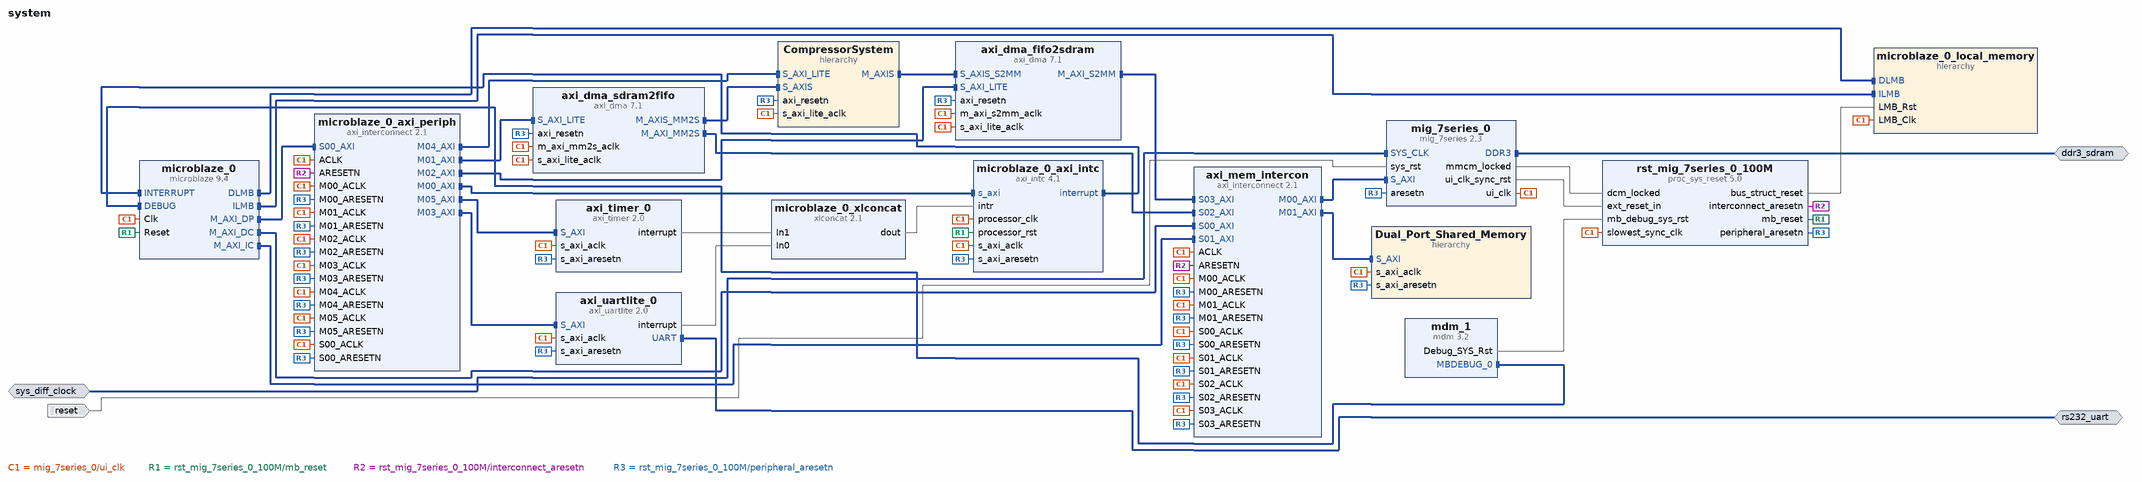
[diagram p0: block diagram of the top level]
# Vivado block design system, Vivado 2014.4
create_bd_design system

create_bd_intf_port -mode Master -vlnv xilinx.com:interface:ddrx_rtl:1.0 ddr3_sdram
create_bd_intf_port -mode Slave -vlnv xilinx.com:interface:diff_clock_rtl:1.0 sys_diff_clock
set_property -dict {CONFIG.FREQ_HZ 100000000} [get_bd_intf_ports sys_diff_clock]
create_bd_intf_port -mode Master -vlnv xilinx.com:interface:uart_rtl:1.0 rs232_uart
create_bd_port -dir I -type rst reset
set_property -dict {CONFIG.POLARITY ACTIVE_HIGH} [get_bd_ports reset]

create_bd_cell -type ip -vlnv xilinx.com:ip:microblaze:9.4 microblaze_0
set_property -dict [list \
  CONFIG.C_D_AXI 1 \
  CONFIG.C_D_LMB 1 \
  CONFIG.C_I_LMB 1 \
  CONFIG.G_TEMPLATE_LIST 2 \
  CONFIG.C_USE_MSR_INSTR 1 \
  CONFIG.C_USE_PCMP_INSTR 1 \
  CONFIG.C_USE_BARREL 1 \
  CONFIG.C_USE_DIV 1 \
  CONFIG.C_USE_HW_MUL 2 \
  CONFIG.C_USE_FPU 2 \
  CONFIG.C_DEBUG_ENABLED 1 \
  CONFIG.C_USE_ICACHE 1 \
  CONFIG.C_CACHE_BYTE_SIZE 32768 \
  CONFIG.C_ICACHE_LINE_LEN 8 \
  CONFIG.C_ICACHE_VICTIMS 8 \
  CONFIG.C_ICACHE_STREAMS 1 \
  CONFIG.C_USE_DCACHE 1 \
  CONFIG.C_DCACHE_BYTE_SIZE 32768 \
  CONFIG.C_DCACHE_LINE_LEN 8 \
  CONFIG.C_DCACHE_USE_WRITEBACK 1 \
  CONFIG.C_DCACHE_VICTIMS 8 \
  CONFIG.C_USE_BRANCH_TARGET_CACHE 1 \
] [get_bd_cells microblaze_0]
create_bd_cell -type ip -vlnv xilinx.com:ip:mig_7series:2.3 mig_7series_0
set_property -dict {CONFIG.RESET_BOARD_INTERFACE reset CONFIG.BOARD_MIG_PARAM ddr3_sdram} [get_bd_cells mig_7series_0]
create_bd_cell -type hier microblaze_0_local_memory
create_bd_cell -type ip -vlnv xilinx.com:ip:axi_interconnect:2.1 microblaze_0_axi_periph
set_property -dict {CONFIG.NUM_MI 6} [get_bd_cells microblaze_0_axi_periph]
create_bd_cell -type ip -vlnv xilinx.com:ip:axi_intc:4.1 microblaze_0_axi_intc
set_property -dict {CONFIG.C_HAS_FAST 1} [get_bd_cells microblaze_0_axi_intc]
create_bd_cell -type ip -vlnv xilinx.com:ip:xlconcat:2.1 microblaze_0_xlconcat
create_bd_cell -type ip -vlnv xilinx.com:ip:mdm:3.2 mdm_1
create_bd_cell -type ip -vlnv xilinx.com:ip:proc_sys_reset:5.0 rst_mig_7series_0_100M
create_bd_cell -type ip -vlnv xilinx.com:ip:axi_dma:7.1 axi_dma_fifo2sdram
set_property -dict {CONFIG.c_include_sg 0 CONFIG.c_sg_length_width 23 CONFIG.c_include_mm2s 0} [get_bd_cells axi_dma_fifo2sdram]
create_bd_cell -type ip -vlnv xilinx.com:ip:axi_uartlite:2.0 axi_uartlite_0
set_property -dict [list \
  CONFIG.C_BAUDRATE 115200 \
  CONFIG.USE_BOARD_FLOW true \
  CONFIG.UARTLITE_BOARD_INTERFACE rs232_uart \
] [get_bd_cells axi_uartlite_0]
create_bd_cell -type ip -vlnv xilinx.com:ip:axi_timer:2.0 axi_timer_0
create_bd_cell -type hier Dual_Port_Shared_Memory
create_bd_cell -type ip -vlnv xilinx.com:ip:axi_interconnect:2.1 axi_mem_intercon
set_property -dict {CONFIG.NUM_SI 4 CONFIG.NUM_MI 2} [get_bd_cells axi_mem_intercon]
create_bd_cell -type hier CompressorSystem
create_bd_cell -type ip -vlnv xilinx.com:ip:axi_dma:7.1 axi_dma_sdram2fifo
set_property -dict {CONFIG.c_include_sg 0 CONFIG.c_sg_length_width 23 CONFIG.c_include_s2mm 0} [get_bd_cells axi_dma_sdram2fifo]

# ---- hierarchy /microblaze_0_local_memory ----
current_bd_instance /microblaze_0_local_memory
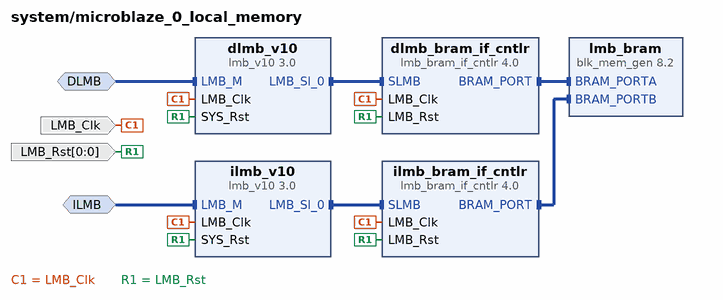
[diagram p1: block diagram inside /microblaze_0_local_memory]
create_bd_intf_pin -mode MirroredMaster -vlnv xilinx.com:interface:lmb_rtl:1.0 DLMB
create_bd_intf_pin -mode MirroredMaster -vlnv xilinx.com:interface:lmb_rtl:1.0 ILMB
create_bd_pin -dir I -type clk LMB_Clk
create_bd_pin -dir I -from 0 -to 0 -type rst LMB_Rst

create_bd_cell -type ip -vlnv xilinx.com:ip:lmb_v10:3.0 dlmb_v10
create_bd_cell -type ip -vlnv xilinx.com:ip:lmb_v10:3.0 ilmb_v10
create_bd_cell -type ip -vlnv xilinx.com:ip:lmb_bram_if_cntlr:4.0 dlmb_bram_if_cntlr
set_property -dict {CONFIG.C_ECC 0} [get_bd_cells dlmb_bram_if_cntlr]
create_bd_cell -type ip -vlnv xilinx.com:ip:lmb_bram_if_cntlr:4.0 ilmb_bram_if_cntlr
set_property -dict {CONFIG.C_ECC 0} [get_bd_cells ilmb_bram_if_cntlr]
create_bd_cell -type ip -vlnv xilinx.com:ip:blk_mem_gen:8.2 lmb_bram
set_property -dict {CONFIG.Memory_Type True_Dual_Port_RAM CONFIG.use_bram_block BRAM_Controller} [get_bd_cells lmb_bram]

# ---- hierarchy /Dual_Port_Shared_Memory ----
current_bd_instance /Dual_Port_Shared_Memory
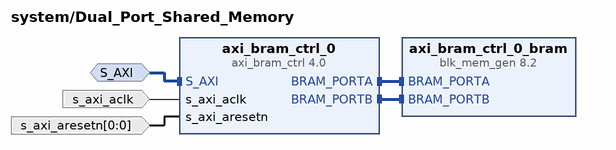
[diagram p2: block diagram inside /Dual_Port_Shared_Memory]
create_bd_intf_pin -mode Slave -vlnv xilinx.com:interface:aximm_rtl:1.0 S_AXI
create_bd_pin -dir I -type clk s_axi_aclk
create_bd_pin -dir I -from 0 -to 0 -type rst s_axi_aresetn

create_bd_cell -type ip -vlnv xilinx.com:ip:axi_bram_ctrl:4.0 axi_bram_ctrl_0
create_bd_cell -type ip -vlnv xilinx.com:ip:blk_mem_gen:8.2 axi_bram_ctrl_0_bram
set_property -dict {CONFIG.Memory_Type True_Dual_Port_RAM} [get_bd_cells axi_bram_ctrl_0_bram]

# ---- hierarchy /CompressorSystem ----
current_bd_instance /CompressorSystem
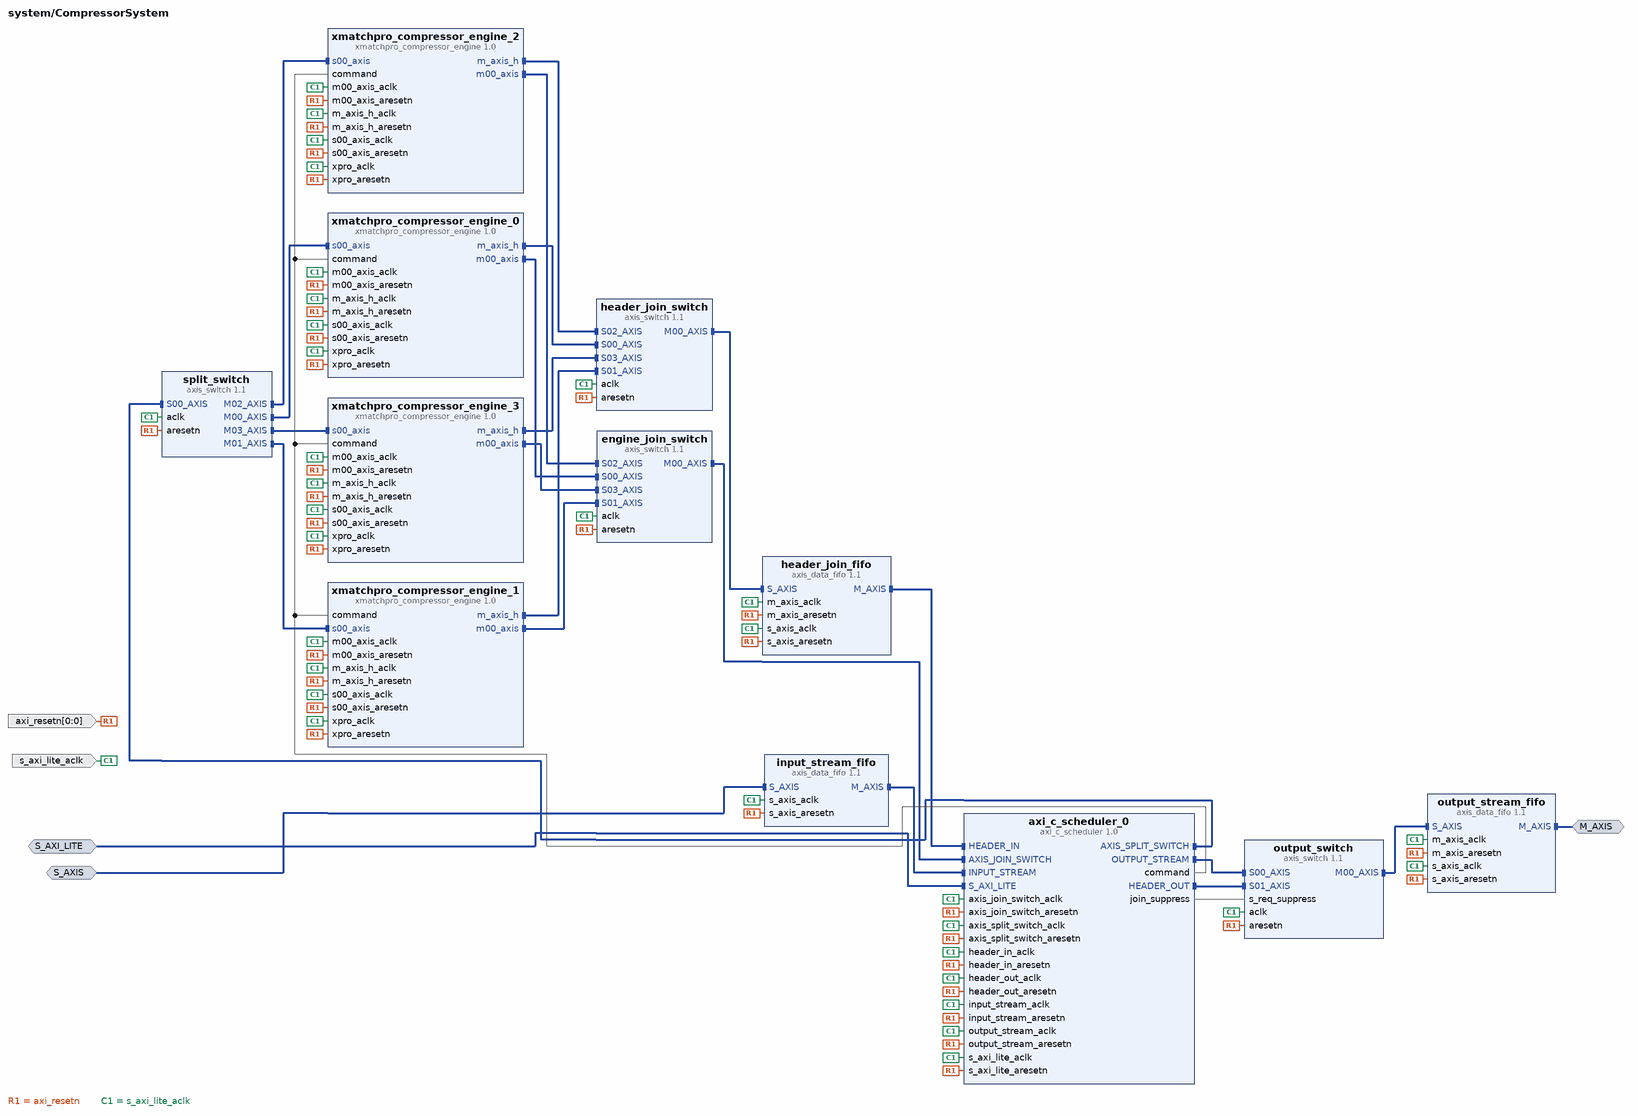
[diagram p3: block diagram inside /CompressorSystem]
create_bd_intf_pin -mode Slave -vlnv xilinx.com:interface:aximm_rtl:1.0 S_AXI_LITE
create_bd_intf_pin -mode Master -vlnv xilinx.com:interface:axis_rtl:1.0 M_AXIS
create_bd_intf_pin -mode Slave -vlnv xilinx.com:interface:axis_rtl:1.0 S_AXIS
create_bd_pin -dir I -from 0 -to 0 -type rst axi_resetn
create_bd_pin -dir I -type clk s_axi_lite_aclk

create_bd_cell -type ip -vlnv mohdazainol:user_ip:xmatchpro_compressor_engine:1.0 xmatchpro_compressor_engine_2
create_bd_cell -type ip -vlnv xilinx.com:ip:axis_switch:1.1 engine_join_switch
set_property -dict [list \
  CONFIG.NUM_SI 4 \
  CONFIG.TDATA_NUM_BYTES 4 \
  CONFIG.HAS_TLAST 1 \
  CONFIG.ARB_ON_MAX_XFERS 0 \
  CONFIG.ARB_ON_TLAST 1 \
] [get_bd_cells engine_join_switch]
create_bd_cell -type ip -vlnv mohdazainol:user_ip:xmatchpro_compressor_engine:1.0 xmatchpro_compressor_engine_3
create_bd_cell -type ip -vlnv xilinx.com:ip:axis_switch:1.1 header_join_switch
set_property -dict [list \
  CONFIG.NUM_SI 4 \
  CONFIG.TDATA_NUM_BYTES 4 \
  CONFIG.HAS_TLAST 1 \
  CONFIG.ARB_ON_MAX_XFERS 0 \
  CONFIG.ARB_ON_TLAST 1 \
] [get_bd_cells header_join_switch]
create_bd_cell -type ip -vlnv xilinx.com:ip:axis_switch:1.1 split_switch
set_property -dict [list \
  CONFIG.NUM_SI 1 \
  CONFIG.NUM_MI 4 \
  CONFIG.TDATA_NUM_BYTES 4 \
  CONFIG.HAS_TLAST 1 \
  CONFIG.TDEST_WIDTH 4 \
  CONFIG.DECODER_REG 1 \
] [get_bd_cells split_switch]
create_bd_cell -type ip -vlnv xilinx.com:ip:axis_data_fifo:1.1 header_join_fifo
set_property -dict [list \
  CONFIG.TDATA_NUM_BYTES 4 \
  CONFIG.IS_ACLK_ASYNC 1 \
  CONFIG.HAS_TLAST 1 \
  CONFIG.SYNCHRONIZATION_STAGES 3 \
] [get_bd_cells header_join_fifo]
create_bd_cell -type ip -vlnv mohdazainol:user_ip:axi_c_scheduler:1.0 axi_c_scheduler_0
create_bd_cell -type ip -vlnv xilinx.com:ip:axis_switch:1.1 output_switch
set_property -dict [list \
  CONFIG.TDATA_NUM_BYTES 4 \
  CONFIG.HAS_TLAST 1 \
  CONFIG.ARB_ON_MAX_XFERS 1024 \
  CONFIG.ARB_ON_NUM_CYCLES 64 \
  CONFIG.ARB_ALGORITHM 1 \
] [get_bd_cells output_switch]
create_bd_cell -type ip -vlnv xilinx.com:ip:axis_data_fifo:1.1 input_stream_fifo
set_property -dict {CONFIG.TDATA_NUM_BYTES 4 CONFIG.IS_ACLK_ASYNC 0 CONFIG.HAS_TLAST 1} [get_bd_cells input_stream_fifo]
create_bd_cell -type ip -vlnv mohdazainol:user_ip:xmatchpro_compressor_engine:1.0 xmatchpro_compressor_engine_0
create_bd_cell -type ip -vlnv mohdazainol:user_ip:xmatchpro_compressor_engine:1.0 xmatchpro_compressor_engine_1
create_bd_cell -type ip -vlnv xilinx.com:ip:axis_data_fifo:1.1 output_stream_fifo
set_property -dict [list \
  CONFIG.TDATA_NUM_BYTES 4 \
  CONFIG.IS_ACLK_ASYNC 1 \
  CONFIG.HAS_TLAST 1 \
  CONFIG.SYNCHRONIZATION_STAGES 3 \
] [get_bd_cells output_stream_fifo]

# ---- connections ----

current_bd_instance /microblaze_0_local_memory
connect_bd_intf_net -intf_net microblaze_0_dlmb_bus [get_bd_intf_pins dlmb_v10/LMB_Sl_0] [get_bd_intf_pins dlmb_bram_if_cntlr/SLMB]
connect_bd_intf_net -intf_net microblaze_0_ilmb_bus [get_bd_intf_pins ilmb_v10/LMB_Sl_0] [get_bd_intf_pins ilmb_bram_if_cntlr/SLMB]
connect_bd_intf_net -intf_net microblaze_0_dlmb_cntlr [get_bd_intf_pins dlmb_bram_if_cntlr/BRAM_PORT] [get_bd_intf_pins lmb_bram/BRAM_PORTA]
connect_bd_intf_net -intf_net microblaze_0_ilmb_cntlr [get_bd_intf_pins ilmb_bram_if_cntlr/BRAM_PORT] [get_bd_intf_pins lmb_bram/BRAM_PORTB]
connect_bd_intf_net -intf_net microblaze_0_dlmb [get_bd_intf_pins DLMB] [get_bd_intf_pins dlmb_v10/LMB_M]
connect_bd_intf_net -intf_net microblaze_0_ilmb [get_bd_intf_pins ILMB] [get_bd_intf_pins ilmb_v10/LMB_M]
connect_bd_net -net microblaze_0_Clk [get_bd_pins LMB_Clk] \
  [get_bd_pins dlmb_v10/LMB_Clk] [get_bd_pins dlmb_bram_if_cntlr/LMB_Clk] [get_bd_pins ilmb_v10/LMB_Clk] \
  [get_bd_pins ilmb_bram_if_cntlr/LMB_Clk]
connect_bd_net -net microblaze_0_LMB_Rst [get_bd_pins LMB_Rst] \
  [get_bd_pins dlmb_v10/SYS_Rst] [get_bd_pins dlmb_bram_if_cntlr/LMB_Rst] [get_bd_pins ilmb_v10/SYS_Rst] \
  [get_bd_pins ilmb_bram_if_cntlr/LMB_Rst]

current_bd_instance /Dual_Port_Shared_Memory
connect_bd_intf_net [get_bd_intf_pins axi_bram_ctrl_0_bram/BRAM_PORTA] [get_bd_intf_pins axi_bram_ctrl_0/BRAM_PORTA]
connect_bd_intf_net [get_bd_intf_pins axi_bram_ctrl_0_bram/BRAM_PORTB] [get_bd_intf_pins axi_bram_ctrl_0/BRAM_PORTB]
connect_bd_intf_net [get_bd_intf_pins S_AXI] [get_bd_intf_pins axi_bram_ctrl_0/S_AXI]
connect_bd_net [get_bd_pins s_axi_aclk] [get_bd_pins axi_bram_ctrl_0/s_axi_aclk]
connect_bd_net [get_bd_pins s_axi_aresetn] [get_bd_pins axi_bram_ctrl_0/s_axi_aresetn]

current_bd_instance /CompressorSystem
connect_bd_intf_net [get_bd_intf_pins split_switch/M02_AXIS] [get_bd_intf_pins xmatchpro_compressor_engine_2/s00_axis]
connect_bd_intf_net [get_bd_intf_pins xmatchpro_compressor_engine_2/m00_axis] [get_bd_intf_pins engine_join_switch/S02_AXIS]
connect_bd_intf_net [get_bd_intf_pins header_join_switch/S02_AXIS] [get_bd_intf_pins xmatchpro_compressor_engine_2/m_axis_h]
connect_bd_intf_net [get_bd_intf_pins xmatchpro_compressor_engine_0/m00_axis] [get_bd_intf_pins engine_join_switch/S00_AXIS]
connect_bd_intf_net [get_bd_intf_pins engine_join_switch/M00_AXIS] [get_bd_intf_pins axi_c_scheduler_0/AXIS_JOIN_SWITCH]
connect_bd_intf_net [get_bd_intf_pins engine_join_switch/S01_AXIS] [get_bd_intf_pins xmatchpro_compressor_engine_1/m00_axis]
connect_bd_intf_net [get_bd_intf_pins engine_join_switch/S03_AXIS] [get_bd_intf_pins xmatchpro_compressor_engine_3/m00_axis]
connect_bd_intf_net [get_bd_intf_pins xmatchpro_compressor_engine_3/s00_axis] [get_bd_intf_pins split_switch/M03_AXIS]
connect_bd_intf_net [get_bd_intf_pins header_join_switch/S03_AXIS] [get_bd_intf_pins xmatchpro_compressor_engine_3/m_axis_h]
connect_bd_intf_net [get_bd_intf_pins header_join_switch/S00_AXIS] [get_bd_intf_pins xmatchpro_compressor_engine_0/m_axis_h]
connect_bd_intf_net [get_bd_intf_pins header_join_switch/M00_AXIS] [get_bd_intf_pins header_join_fifo/S_AXIS]
connect_bd_intf_net [get_bd_intf_pins xmatchpro_compressor_engine_1/m_axis_h] [get_bd_intf_pins header_join_switch/S01_AXIS]
connect_bd_intf_net [get_bd_intf_pins axi_c_scheduler_0/AXIS_SPLIT_SWITCH] [get_bd_intf_pins split_switch/S00_AXIS]
connect_bd_intf_net [get_bd_intf_pins split_switch/M00_AXIS] [get_bd_intf_pins xmatchpro_compressor_engine_0/s00_axis]
connect_bd_intf_net [get_bd_intf_pins xmatchpro_compressor_engine_1/s00_axis] [get_bd_intf_pins split_switch/M01_AXIS]
connect_bd_intf_net [get_bd_intf_pins header_join_fifo/M_AXIS] [get_bd_intf_pins axi_c_scheduler_0/HEADER_IN]
connect_bd_intf_net [get_bd_intf_pins input_stream_fifo/M_AXIS] [get_bd_intf_pins axi_c_scheduler_0/INPUT_STREAM]
connect_bd_intf_net [get_bd_intf_pins output_switch/S00_AXIS] [get_bd_intf_pins axi_c_scheduler_0/OUTPUT_STREAM]
connect_bd_intf_net [get_bd_intf_pins axi_c_scheduler_0/HEADER_OUT] [get_bd_intf_pins output_switch/S01_AXIS]
connect_bd_intf_net -intf_net axis_switch_0_M00_AXIS [get_bd_intf_pins output_stream_fifo/S_AXIS] [get_bd_intf_pins output_switch/M00_AXIS]
connect_bd_intf_net [get_bd_intf_pins S_AXI_LITE] [get_bd_intf_pins axi_c_scheduler_0/S_AXI_LITE]
connect_bd_intf_net [get_bd_intf_pins M_AXIS] [get_bd_intf_pins output_stream_fifo/M_AXIS]
connect_bd_intf_net [get_bd_intf_pins S_AXIS] [get_bd_intf_pins input_stream_fifo/S_AXIS]
connect_bd_net [get_bd_pins axi_c_scheduler_0/command] \
  [get_bd_pins xmatchpro_compressor_engine_0/command] [get_bd_pins xmatchpro_compressor_engine_1/command] \
  [get_bd_pins xmatchpro_compressor_engine_2/command] [get_bd_pins xmatchpro_compressor_engine_3/command]
connect_bd_net [get_bd_pins axi_c_scheduler_0/join_suppress] [get_bd_pins output_switch/s_req_suppress]
connect_bd_net -net rst_mig_7series_0_100M_peripheral_aresetn [get_bd_pins axi_resetn] \
  [get_bd_pins split_switch/aresetn] [get_bd_pins input_stream_fifo/s_axis_aresetn] [get_bd_pins engine_join_switch/aresetn] \
  [get_bd_pins header_join_switch/aresetn] [get_bd_pins header_join_fifo/m_axis_aresetn] \
  [get_bd_pins header_join_fifo/s_axis_aresetn] [get_bd_pins output_switch/aresetn] \
  [get_bd_pins output_stream_fifo/m_axis_aresetn] [get_bd_pins output_stream_fifo/s_axis_aresetn] \
  [get_bd_pins xmatchpro_compressor_engine_0/s00_axis_aresetn] [get_bd_pins xmatchpro_compressor_engine_0/m00_axis_aresetn] \
  [get_bd_pins xmatchpro_compressor_engine_0/xpro_aresetn] [get_bd_pins xmatchpro_compressor_engine_0/m_axis_h_aresetn] \
  [get_bd_pins xmatchpro_compressor_engine_1/s00_axis_aresetn] [get_bd_pins xmatchpro_compressor_engine_1/m00_axis_aresetn] \
  [get_bd_pins xmatchpro_compressor_engine_1/xpro_aresetn] [get_bd_pins xmatchpro_compressor_engine_1/m_axis_h_aresetn] \
  [get_bd_pins xmatchpro_compressor_engine_2/m00_axis_aresetn] [get_bd_pins xmatchpro_compressor_engine_2/xpro_aresetn] \
  [get_bd_pins xmatchpro_compressor_engine_2/m_axis_h_aresetn] [get_bd_pins xmatchpro_compressor_engine_3/s00_axis_aresetn] \
  [get_bd_pins xmatchpro_compressor_engine_3/m00_axis_aresetn] [get_bd_pins xmatchpro_compressor_engine_3/xpro_aresetn] \
  [get_bd_pins xmatchpro_compressor_engine_3/m_axis_h_aresetn] [get_bd_pins axi_c_scheduler_0/axis_join_switch_aresetn] \
  [get_bd_pins axi_c_scheduler_0/s_axi_lite_aresetn] [get_bd_pins axi_c_scheduler_0/input_stream_aresetn] \
  [get_bd_pins axi_c_scheduler_0/axis_split_switch_aresetn] [get_bd_pins axi_c_scheduler_0/header_out_aresetn] \
  [get_bd_pins axi_c_scheduler_0/output_stream_aresetn] [get_bd_pins axi_c_scheduler_0/header_in_aresetn] \
  [get_bd_pins xmatchpro_compressor_engine_2/s00_axis_aresetn]
connect_bd_net -net microblaze_0_Clk [get_bd_pins s_axi_lite_aclk] \
  [get_bd_pins split_switch/aclk] [get_bd_pins input_stream_fifo/s_axis_aclk] [get_bd_pins engine_join_switch/aclk] \
  [get_bd_pins header_join_switch/aclk] [get_bd_pins header_join_fifo/s_axis_aclk] [get_bd_pins header_join_fifo/m_axis_aclk] \
  [get_bd_pins output_switch/aclk] [get_bd_pins output_stream_fifo/s_axis_aclk] [get_bd_pins output_stream_fifo/m_axis_aclk] \
  [get_bd_pins xmatchpro_compressor_engine_0/s00_axis_aclk] [get_bd_pins xmatchpro_compressor_engine_0/m00_axis_aclk] \
  [get_bd_pins xmatchpro_compressor_engine_0/xpro_aclk] [get_bd_pins xmatchpro_compressor_engine_0/m_axis_h_aclk] \
  [get_bd_pins xmatchpro_compressor_engine_1/s00_axis_aclk] [get_bd_pins xmatchpro_compressor_engine_1/m00_axis_aclk] \
  [get_bd_pins xmatchpro_compressor_engine_1/xpro_aclk] [get_bd_pins xmatchpro_compressor_engine_1/m_axis_h_aclk] \
  [get_bd_pins xmatchpro_compressor_engine_2/m00_axis_aclk] [get_bd_pins xmatchpro_compressor_engine_2/xpro_aclk] \
  [get_bd_pins xmatchpro_compressor_engine_2/m_axis_h_aclk] [get_bd_pins xmatchpro_compressor_engine_3/s00_axis_aclk] \
  [get_bd_pins xmatchpro_compressor_engine_3/m00_axis_aclk] [get_bd_pins xmatchpro_compressor_engine_3/xpro_aclk] \
  [get_bd_pins xmatchpro_compressor_engine_3/m_axis_h_aclk] [get_bd_pins axi_c_scheduler_0/axis_join_switch_aclk] \
  [get_bd_pins axi_c_scheduler_0/s_axi_lite_aclk] [get_bd_pins axi_c_scheduler_0/input_stream_aclk] \
  [get_bd_pins axi_c_scheduler_0/axis_split_switch_aclk] [get_bd_pins axi_c_scheduler_0/header_out_aclk] \
  [get_bd_pins axi_c_scheduler_0/output_stream_aclk] [get_bd_pins axi_c_scheduler_0/header_in_aclk] \
  [get_bd_pins xmatchpro_compressor_engine_2/s00_axis_aclk]

current_bd_instance /
connect_bd_intf_net [get_bd_intf_pins microblaze_0/DLMB] [get_bd_intf_pins microblaze_0_local_memory/DLMB]
connect_bd_intf_net [get_bd_intf_pins microblaze_0/ILMB] [get_bd_intf_pins microblaze_0_local_memory/ILMB]
connect_bd_intf_net -intf_net microblaze_0_axi_dp [get_bd_intf_pins microblaze_0_axi_periph/S00_AXI] [get_bd_intf_pins microblaze_0/M_AXI_DP]
connect_bd_intf_net [get_bd_intf_pins microblaze_0_axi_intc/interrupt] [get_bd_intf_pins microblaze_0/INTERRUPT]
connect_bd_intf_net -intf_net microblaze_0_intc_axi [get_bd_intf_pins microblaze_0_axi_periph/M00_AXI] [get_bd_intf_pins microblaze_0_axi_intc/s_axi]
connect_bd_intf_net [get_bd_intf_pins mdm_1/MBDEBUG_0] [get_bd_intf_pins microblaze_0/DEBUG]
connect_bd_intf_net [get_bd_intf_pins microblaze_0_axi_periph/M02_AXI] [get_bd_intf_pins axi_dma_fifo2sdram/S_AXI_LITE]
connect_bd_intf_net [get_bd_intf_pins microblaze_0_axi_periph/M03_AXI] [get_bd_intf_pins axi_uartlite_0/S_AXI]
connect_bd_intf_net [get_bd_intf_pins microblaze_0_axi_periph/M04_AXI] [get_bd_intf_pins CompressorSystem/S_AXI_LITE]
connect_bd_intf_net [get_bd_intf_pins microblaze_0_axi_periph/M05_AXI] [get_bd_intf_pins axi_timer_0/S_AXI]
connect_bd_intf_net [get_bd_intf_pins microblaze_0/M_AXI_DC] [get_bd_intf_pins axi_mem_intercon/S00_AXI]
connect_bd_intf_net [get_bd_intf_pins axi_mem_intercon/M00_AXI] [get_bd_intf_pins mig_7series_0/S_AXI]
connect_bd_intf_net [get_bd_intf_pins microblaze_0/M_AXI_IC] [get_bd_intf_pins axi_mem_intercon/S01_AXI]
connect_bd_intf_net [get_bd_intf_pins axi_mem_intercon/M01_AXI] [get_bd_intf_pins Dual_Port_Shared_Memory/S_AXI]
connect_bd_intf_net [get_bd_intf_pins axi_dma_fifo2sdram/M_AXI_S2MM] [get_bd_intf_pins axi_mem_intercon/S03_AXI]
connect_bd_intf_net -intf_net output_stream_fifo_M_AXIS [get_bd_intf_pins CompressorSystem/M_AXIS] [get_bd_intf_pins axi_dma_fifo2sdram/S_AXIS_S2MM]
connect_bd_intf_net [get_bd_intf_pins axi_dma_sdram2fifo/M_AXIS_MM2S] [get_bd_intf_pins CompressorSystem/S_AXIS]
connect_bd_intf_net [get_bd_intf_pins axi_mem_intercon/S02_AXI] [get_bd_intf_pins axi_dma_sdram2fifo/M_AXI_MM2S]
connect_bd_intf_net [get_bd_intf_pins microblaze_0_axi_periph/M01_AXI] [get_bd_intf_pins axi_dma_sdram2fifo/S_AXI_LITE]
connect_bd_intf_net [get_bd_intf_ports ddr3_sdram] [get_bd_intf_pins mig_7series_0/DDR3]
connect_bd_intf_net [get_bd_intf_ports sys_diff_clock] [get_bd_intf_pins mig_7series_0/SYS_CLK]
connect_bd_intf_net [get_bd_intf_ports rs232_uart] [get_bd_intf_pins axi_uartlite_0/UART]
connect_bd_net -net microblaze_0_intr [get_bd_pins microblaze_0_xlconcat/dout] [get_bd_pins microblaze_0_axi_intc/intr]
connect_bd_net -net microblaze_0_Clk [get_bd_pins mig_7series_0/ui_clk] \
  [get_bd_pins microblaze_0/Clk] [get_bd_pins microblaze_0_axi_intc/s_axi_aclk] \
  [get_bd_pins microblaze_0_axi_intc/processor_clk] [get_bd_pins microblaze_0_local_memory/LMB_Clk] \
  [get_bd_pins rst_mig_7series_0_100M/slowest_sync_clk] [get_bd_pins axi_dma_fifo2sdram/s_axi_lite_aclk] \
  [get_bd_pins axi_uartlite_0/s_axi_aclk] [get_bd_pins axi_timer_0/s_axi_aclk] \
  [get_bd_pins Dual_Port_Shared_Memory/s_axi_aclk] [get_bd_pins axi_dma_fifo2sdram/m_axi_s2mm_aclk] \
  [get_bd_pins CompressorSystem/s_axi_lite_aclk] [get_bd_pins axi_dma_sdram2fifo/m_axi_mm2s_aclk] \
  [get_bd_pins axi_dma_sdram2fifo/s_axi_lite_aclk] [get_bd_pins microblaze_0_axi_periph/ACLK] \
  [get_bd_pins microblaze_0_axi_periph/S00_ACLK] [get_bd_pins microblaze_0_axi_periph/M00_ACLK] \
  [get_bd_pins microblaze_0_axi_periph/M01_ACLK] [get_bd_pins microblaze_0_axi_periph/M02_ACLK] \
  [get_bd_pins microblaze_0_axi_periph/M03_ACLK] [get_bd_pins microblaze_0_axi_periph/M04_ACLK] \
  [get_bd_pins microblaze_0_axi_periph/M05_ACLK] [get_bd_pins axi_mem_intercon/S00_ACLK] [get_bd_pins axi_mem_intercon/ACLK] \
  [get_bd_pins axi_mem_intercon/S01_ACLK] [get_bd_pins axi_mem_intercon/M00_ACLK] [get_bd_pins axi_mem_intercon/M01_ACLK] \
  [get_bd_pins axi_mem_intercon/S02_ACLK] [get_bd_pins axi_mem_intercon/S03_ACLK]
connect_bd_net [get_bd_pins mig_7series_0/mmcm_locked] [get_bd_pins rst_mig_7series_0_100M/dcm_locked]
connect_bd_net [get_bd_pins mig_7series_0/ui_clk_sync_rst] [get_bd_pins rst_mig_7series_0_100M/ext_reset_in]
connect_bd_net [get_bd_pins rst_mig_7series_0_100M/mb_reset] [get_bd_pins microblaze_0/Reset] [get_bd_pins microblaze_0_axi_intc/processor_rst]
connect_bd_net [get_bd_pins rst_mig_7series_0_100M/bus_struct_reset] [get_bd_pins microblaze_0_local_memory/LMB_Rst]
connect_bd_net [get_bd_pins rst_mig_7series_0_100M/interconnect_aresetn] \
  [get_bd_pins microblaze_0_axi_periph/ARESETN] [get_bd_pins axi_mem_intercon/ARESETN]
connect_bd_net [get_bd_pins rst_mig_7series_0_100M/peripheral_aresetn] \
  [get_bd_pins microblaze_0_axi_intc/s_axi_aresetn] [get_bd_pins axi_dma_fifo2sdram/axi_resetn] \
  [get_bd_pins axi_uartlite_0/s_axi_aresetn] [get_bd_pins axi_timer_0/s_axi_aresetn] [get_bd_pins mig_7series_0/aresetn] \
  [get_bd_pins Dual_Port_Shared_Memory/s_axi_aresetn] [get_bd_pins CompressorSystem/axi_resetn] \
  [get_bd_pins axi_dma_sdram2fifo/axi_resetn] [get_bd_pins microblaze_0_axi_periph/S00_ARESETN] \
  [get_bd_pins microblaze_0_axi_periph/M00_ARESETN] [get_bd_pins microblaze_0_axi_periph/M01_ARESETN] \
  [get_bd_pins microblaze_0_axi_periph/M02_ARESETN] [get_bd_pins microblaze_0_axi_periph/M03_ARESETN] \
  [get_bd_pins microblaze_0_axi_periph/M04_ARESETN] [get_bd_pins microblaze_0_axi_periph/M05_ARESETN] \
  [get_bd_pins axi_mem_intercon/S00_ARESETN] [get_bd_pins axi_mem_intercon/S01_ARESETN] \
  [get_bd_pins axi_mem_intercon/M00_ARESETN] [get_bd_pins axi_mem_intercon/M01_ARESETN] \
  [get_bd_pins axi_mem_intercon/S02_ARESETN] [get_bd_pins axi_mem_intercon/S03_ARESETN]
connect_bd_net [get_bd_pins mdm_1/Debug_SYS_Rst] [get_bd_pins rst_mig_7series_0_100M/mb_debug_sys_rst]
connect_bd_net [get_bd_ports reset] [get_bd_pins mig_7series_0/sys_rst]
connect_bd_net [get_bd_pins axi_timer_0/interrupt] [get_bd_pins microblaze_0_xlconcat/In1]
connect_bd_net [get_bd_pins axi_uartlite_0/interrupt] [get_bd_pins microblaze_0_xlconcat/In0]

# ---- address map ----
assign_bd_address -offset 0x80000000 -range 1G -target_address_space [get_bd_addr_spaces axi_dma_fifo2sdram/Data_S2MM] [get_bd_addr_segs mig_7series_0/memmap/memaddr]
assign_bd_address -offset 0xC0000000 -range 8K -target_address_space [get_bd_addr_spaces axi_dma_fifo2sdram/Data_S2MM] [get_bd_addr_segs Dual_Port_Shared_Memory/axi_bram_ctrl_0/S_AXI/Mem0]
assign_bd_address -offset 0x80000000 -range 1G -target_address_space [get_bd_addr_spaces axi_dma_sdram2fifo/Data_MM2S] [get_bd_addr_segs mig_7series_0/memmap/memaddr]
assign_bd_address -offset 0xC0000000 -range 8K -target_address_space [get_bd_addr_spaces axi_dma_sdram2fifo/Data_MM2S] [get_bd_addr_segs Dual_Port_Shared_Memory/axi_bram_ctrl_0/S_AXI/Mem0]
assign_bd_address -offset 0x0 -range 128K -target_address_space [get_bd_addr_spaces microblaze_0/Data] [get_bd_addr_segs microblaze_0_local_memory/dlmb_bram_if_cntlr/SLMB/Mem]
assign_bd_address -offset 0x40600000 -range 64K -target_address_space [get_bd_addr_spaces microblaze_0/Data] [get_bd_addr_segs axi_uartlite_0/S_AXI/Reg]
assign_bd_address -offset 0x41200000 -range 64K -target_address_space [get_bd_addr_spaces microblaze_0/Data] [get_bd_addr_segs microblaze_0_axi_intc/s_axi/Reg]
assign_bd_address -offset 0x41C00000 -range 64K -target_address_space [get_bd_addr_spaces microblaze_0/Data] [get_bd_addr_segs axi_timer_0/S_AXI/Reg]
assign_bd_address -offset 0x41E00000 -range 64K -target_address_space [get_bd_addr_spaces microblaze_0/Data] [get_bd_addr_segs axi_dma_sdram2fifo/S_AXI_LITE/Reg]
assign_bd_address -offset 0x41E10000 -range 64K -target_address_space [get_bd_addr_spaces microblaze_0/Data] [get_bd_addr_segs axi_dma_fifo2sdram/S_AXI_LITE/Reg]
assign_bd_address -offset 0x44A00000 -range 64K -target_address_space [get_bd_addr_spaces microblaze_0/Data] [get_bd_addr_segs CompressorSystem/axi_c_scheduler_0/S_AXI_LITE/S_AXI_LITE_reg]
assign_bd_address -offset 0x80000000 -range 1G -target_address_space [get_bd_addr_spaces microblaze_0/Data] [get_bd_addr_segs mig_7series_0/memmap/memaddr]
assign_bd_address -offset 0xC0000000 -range 8K -target_address_space [get_bd_addr_spaces microblaze_0/Data] [get_bd_addr_segs Dual_Port_Shared_Memory/axi_bram_ctrl_0/S_AXI/Mem0]
assign_bd_address -offset 0x0 -range 128K -target_address_space [get_bd_addr_spaces microblaze_0/Instruction] [get_bd_addr_segs microblaze_0_local_memory/ilmb_bram_if_cntlr/SLMB/Mem]
assign_bd_address -offset 0x80000000 -range 1G -target_address_space [get_bd_addr_spaces microblaze_0/Instruction] [get_bd_addr_segs mig_7series_0/memmap/memaddr]
assign_bd_address -offset 0xC0000000 -range 8K -target_address_space [get_bd_addr_spaces microblaze_0/Instruction] [get_bd_addr_segs Dual_Port_Shared_Memory/axi_bram_ctrl_0/S_AXI/Mem0]

validate_bd_design
save_bd_design
